# EasyEDA schematic sche.json
TITLE: Sheet_1; REV: 1.0; Date: 2020-10-10; Sheet: 1/1; Drawn By: wivach; Company: Your Company
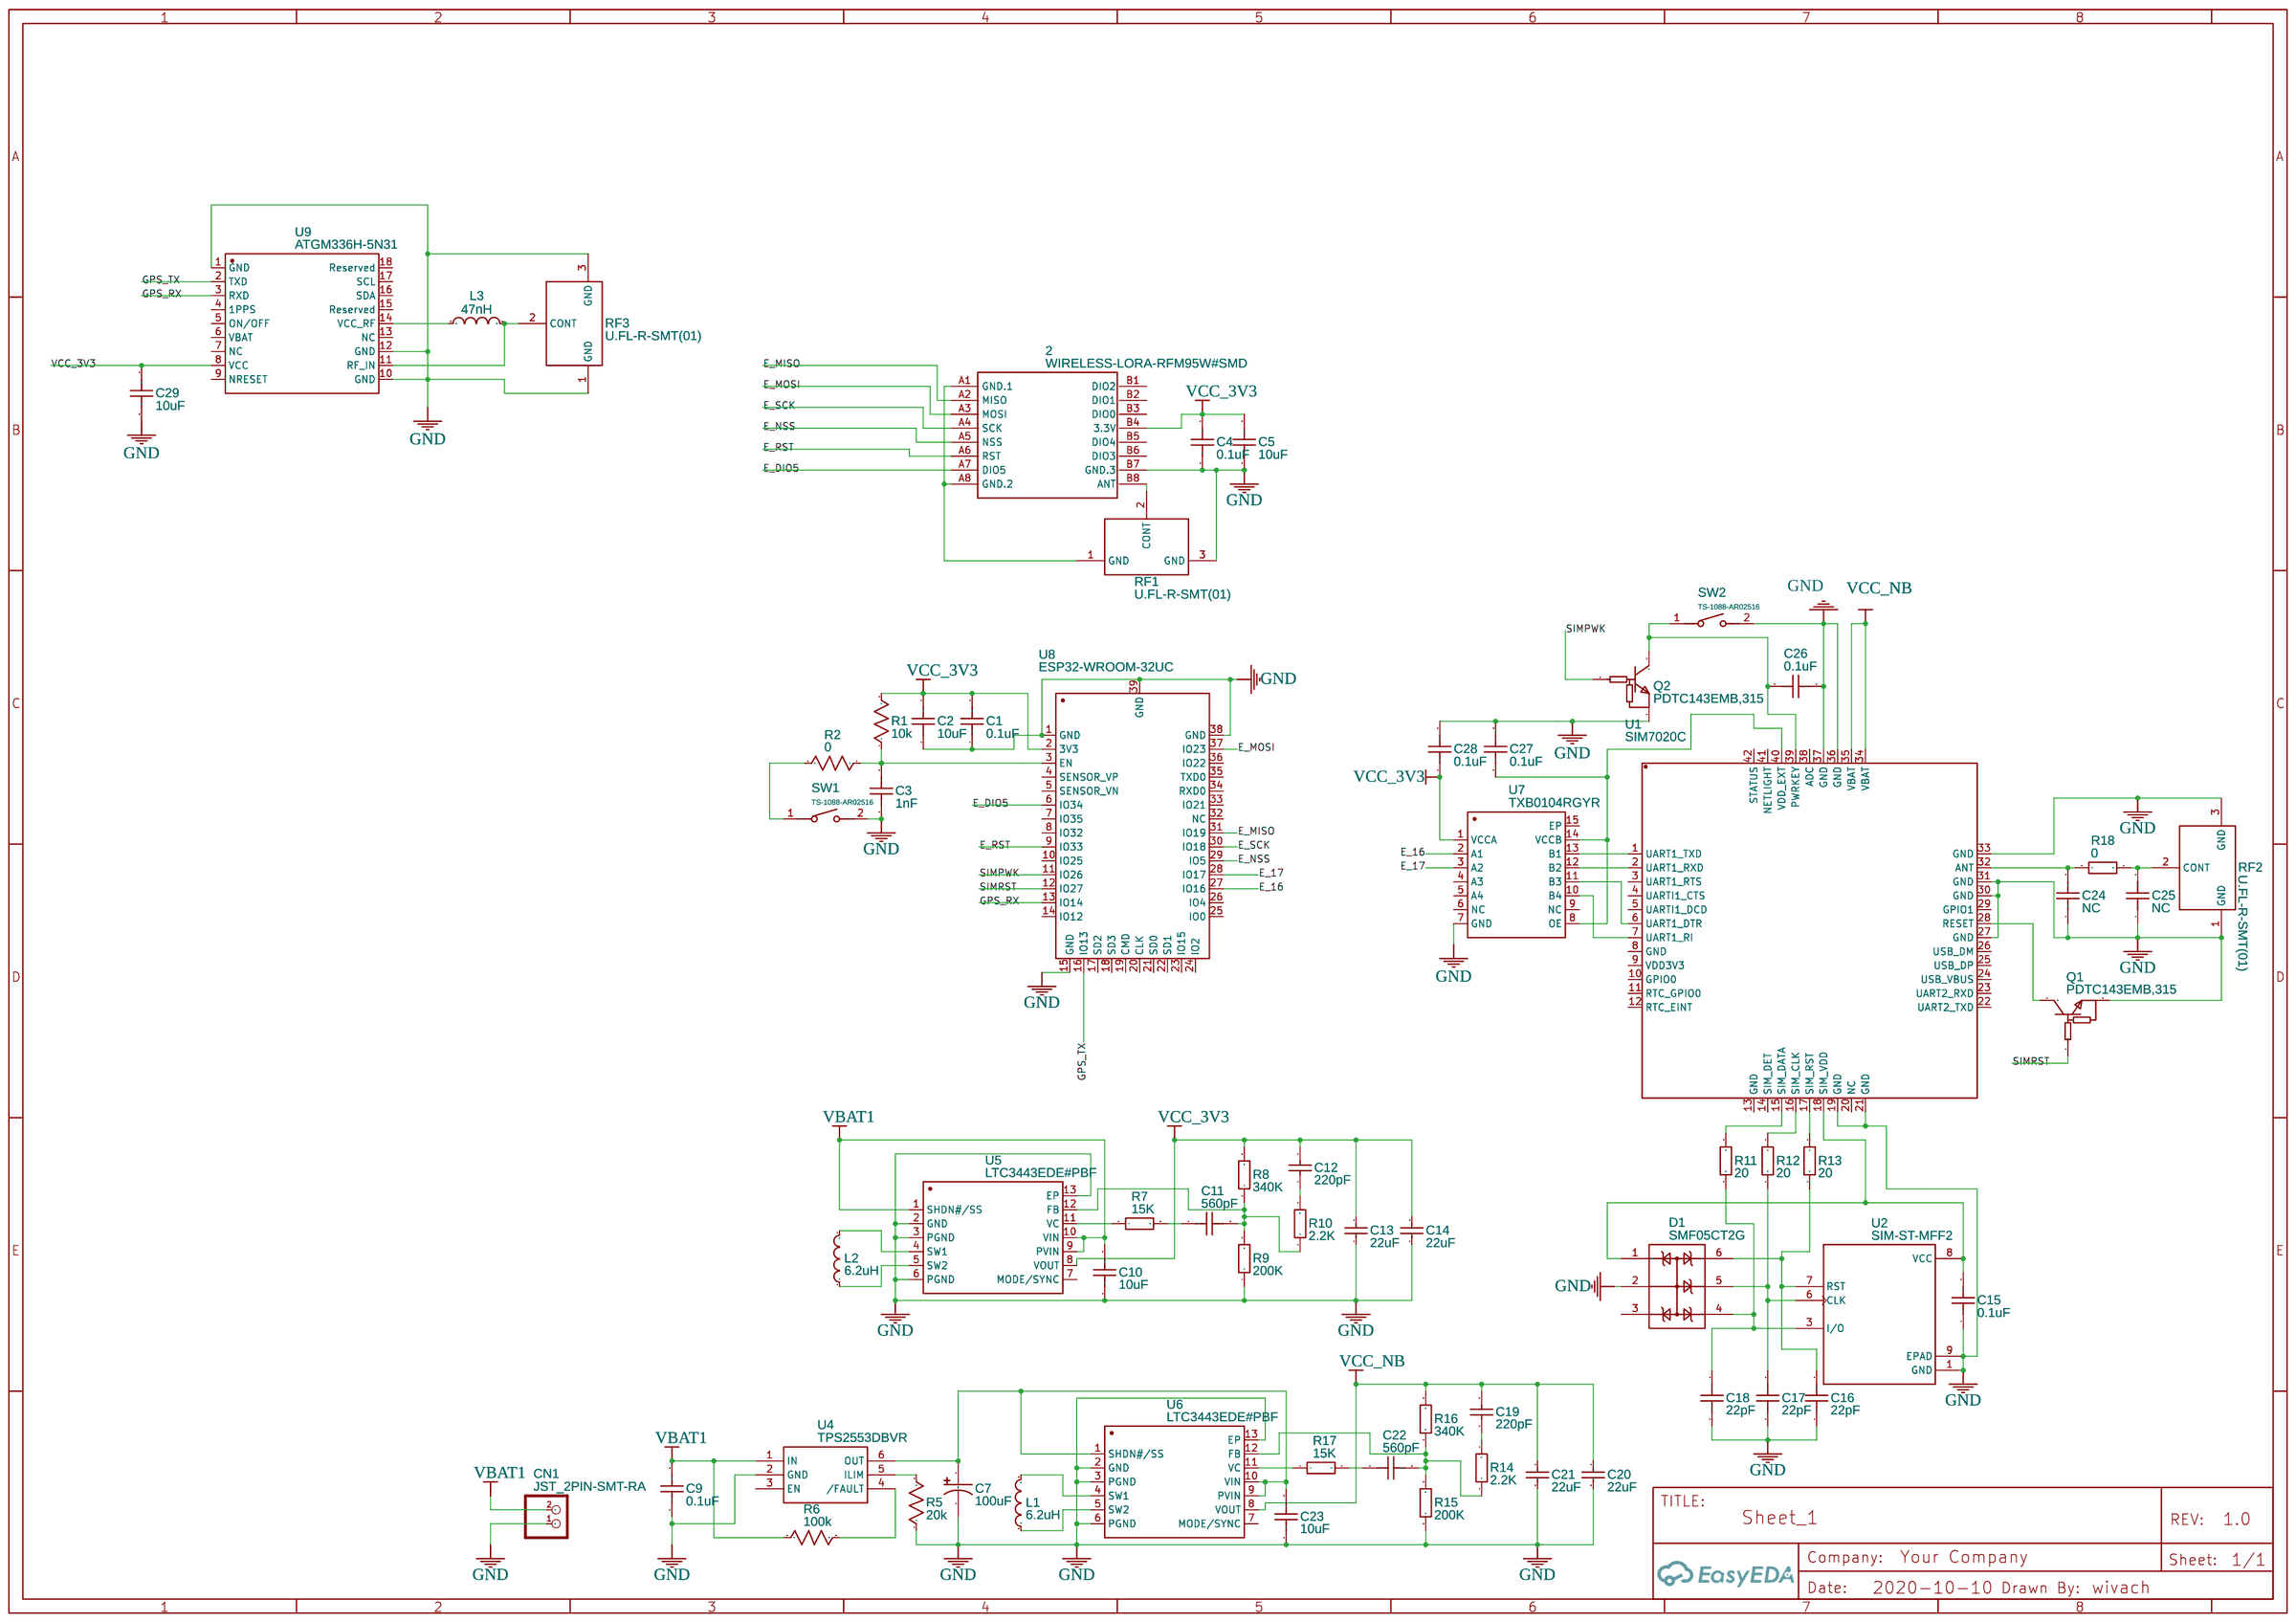
[diagram p0: schematic sheet]

## Parts
2  WIRELESS-LORA-RFM95W#SMD  [WIRELESS-LORA-RFM95W#SMD]
C1  0.1uF  [C0603]
C2  10uF  [C0603]
C3  1nF  [C0603]
C4  0.1uF  [C0603]
C5  10uF  [C0603]
C7  100uF  [CAP-SMD_L3.5-W2.8-R-RD]
C9  0.1uF  [C0603]
C10  10uF  [C0805]
C11  560pF  [C0603]
C12  220pF  [C0603]
C13  22uF  [C1206]
C14  22uF  [C1206]
C15  0.1uF  [C0603]
C16  22pF  [C0603]
C17  22pF  [C0603]
C18  22pF  [C0603]
C19  220pF  [C0603]
C20  22uF  [C1206]
C21  22uF  [C1206]
C22  560pF  [C0603]
C23  10uF  [C0805]
C24  NC  [C0603]
C25  NC  [C0603]
C26  0.1uF  [C0603]
C27  0.1uF  [C0603]
C28  0.1uF  [C0603]
C29  10uF  [C0603]
CN1  JST_2PIN-SMT-RA  [JST-PH-2-SMT-RA]
D1  SMF05CT2G  [SC-88-6_L2.0-W1.3-P0.65-LS2.1-BR]
L1  6.2uH  [IND-SMD_L6.0-W6.0]
L2  6.2uH  [IND-SMD_L6.0-W6.0]
L3  47nH  [IND-SMD_L6.0-W6.0]
Q1  PDTC143EMB,315  [SOT-883-3_L1.0-W0.6-BR]
Q2  PDTC143EMB,315  [SOT-883-3_L1.0-W0.6-BR]
R1  10k  [R0603]
R2  0  [R0603]
R5  20k  [R0603]
R6  100k  [R0603]
R7  15K  [R0603]
R8  340K  [R0603]
R9  200K  [R0603]
R10  2.2K  [R0603]
R11  20  [R0603]
R12  20  [R0603]
R13  20  [R0603]
R14  2.2K  [R0603]
R15  200K  [R0603]
R16  340K  [R0603]
R17  15K  [R0603]
R18  0  [R0603]
RF1  U.FL-R-SMT(01)  [ANT-SMD_UFL-R-SMT01]
RF2  U.FL-R-SMT(01)  [ANT-SMD_UFL-R-SMT01]
RF3  U.FL-R-SMT(01)  [ANT-SMD_UFL-R-SMT01]
SW1  TS-1088-AR02516  [SW-SMD_L4.0-W2.9-LS5.0]
SW2  TS-1088-AR02516  [SW-SMD_L4.0-W2.9-LS5.0]
U1  SIM7020C  [GSM-SMD_42P-L17.6-W15.7-P1.10-TL]
U2  SIM-ST-MFF2  [PSON127P500X600X82-9N]
U4  TPS2553DBVR  [SOT-23-6_L2.9-W1.6-P0.95-LS2.8-BR]
U5  LTC3443EDE#PBF  [DFN-12_L4.0-W3.0-P0.50-BL-EP]
U6  LTC3443EDE#PBF  [DFN-12_L4.0-W3.0-P0.50-BL-EP]
U7  TXB0104RGYR  [VQFN-14_L3.5-W3.5-P0.50-BL-EP]
U8  ESP32-WROOM-32UC  [WIFIM-SMD_38P-L19.2-W18.0-P1.27]
U9  ATGM336H-5N31  [GPSM-SMD_ATGM336H]

## Library data of the parts
2 = WIRELESS-LORA-RFM95W#SMD: Contributor: gtanaka6
C1 C4 C9 C15 C26-C28 = C_0603_US: Supplier Part: C77055; Supplier: LCSC; Contributor: LCEDA_Lib; Manufacturer Part: GRM188R71H104KA93D; Manufacturer: MuRata
C2 C5 C29 = C_0603_US: Supplier Part: C77041; Supplier: LCSC; Contributor: LCEDA_Lib; Manufacturer Part: GRM188R60J106ME47D; Package Display: No; Manufacturer: MuRata
C3 = C_0603_US: Supplier Part: C282515; Supplier: LCSC; Contributor: LCEDA_Lib; Manufacturer Part: TCC0603X7R102K500CT; Manufacturer: CCTC
C7 = TC212B107M010Y: Supplier: LCSC; Manufacturer: Sunlord; Contributor: LCSC; Supplier Part: C110782; LCSC Assembly: Yes; SMT Type: Extend
C10 C23 = C0805X5R106K160NT: Supplier: LCSC; Supplier Part: C466793; Manufacturer: SANYEAR; Contributor: LCSC
C11 C22 = 0603CG561J500NT: Supplier: LCSC; Supplier Part: C43962; Manufacturer: FH(Guangdong Fenghua Advanced Tech); Contributor: LCSC
C12 C19 = CL10B221KB8NNNC: Supplier: LCSC; Manufacturer: SAMSUNG; LCSC Assembly: Yes; Supplier Part: C1603; SMT Type: Basic
C13 C14 C20 C21 = JMK316ABJ226KL-T: Supplier: LCSC; Supplier Part: C478848; Manufacturer: Taiyo Yuden; Contributor: LCSC
C16-C18 = CC0603GRNPO9BN220: Supplier: LCSC; Supplier Part: C327276; Manufacturer: YAGEO; Contributor: LCSC
C24 C25 = C_0603_US: Contributor: LCEDA_Lib
CN1 = JST_2PIN-SMT-RA: JST 2-Pin Connectors of various flavors; Contributor: Adafruit; Manufacturer Part: S2B-PH-SM4-TB(LF)(SN); Supplier: LCSC; Manufacturer: JST Sales America; Supplier Part: C295747
D1 = SMF05CT2G: Supplier: LCSC; Supplier Part: C513065; Manufacturer: ON Semiconductor; Contributor: LCSC
L1-L3 = CDRH5D28NP-6R2NC: Supplier: LCSC; Supplier Part: C312979; Manufacturer: Sumida; Contributor: LCSC
Q1 Q2 = PDTC143EMB,315: Supplier: LCSC; Supplier Part: C552203; Manufacturer: Nexperia; Contributor: LCSC
R1 = R_0603_US: Supplier Part: C177337; Supplier: LCSC; Contributor: LCEDA_Lib; Manufacturer Part: RCT0310KJLF; Manufacturer: Hong Kong Resistors
R2 = R_0603_US: Supplier Part: C21189; Supplier: LCSC; Contributor: LCEDA_Lib; Manufacturer Part: 0603WAF0000T5E; Manufacturer: UniOhm
R5 = R_0603_US: Supplier Part: C305157; Supplier: LCSC; Contributor: LCEDA_Lib; Manufacturer Part: SR06X203JTL; Manufacturer: Huaxin S&T
R6 = R_0603_US: Supplier Part: C106230; Supplier: LCSC; Contributor: LCEDA_Lib; Manufacturer Part: RC0201JR-07100KL; Manufacturer: YAGEO
R7 R17 = ETCR0603F15K0K9: Supplier: LCSC; Supplier Part: C365386; Manufacturer: ResistorToday; Contributor: LCSC
R8 R16 = AC0603FR-07340KL: Supplier: LCSC; Supplier Part: C227826; Manufacturer: YAGEO; Contributor: LCSC
R9 R15 = AF0603FR-07200KL: Supplier: LCSC; Manufacturer: YAGEO; Contributor: LCSC; Supplier Part: C144091
R10 R14 = RMC06032.2K5%N: Supplier: LCSC; Supplier Part: C325643; Manufacturer: Tyohm; Contributor: LCSC
R11-R13 = ERJUP3F20R0V: Supplier: LCSC; Supplier Part: C544033; Manufacturer: PANASONIC; Contributor: LCSC
R18 = ERJUP3F20R0V: Supplier: LCSC; Supplier Part: C544033; Manufacturer: PANASONIC; Contributor: LCSC; Package Display: No
RF1-RF3 = U.FL-R-SMT(01): Supplier: LCSC; Supplier Part: C434812; Manufacturer: Hirose; Contributor: LCSC
SW1 SW2 = TS-1088-AR02516: Supplier: LCSC; Supplier Part: C720478; Manufacturer: XUNPU; Contributor: LCSC
U1 = SIM7020C: Supplier: LCSC; Supplier Part: C188351; Manufacturer: SIMCom Wireless Solutions; Contributor: LCSC
U2 = SIM-ST-MFF2: Contributor: Bharathmc; Package Display: No
U4 = TPS2553DBVR: Supplier: LCSC; Manufacturer: TI; image: //image.lceda.cn/szlcsc/C55266.jpg; Supplier Part: C55266; LCSC Assembly: Yes; SMT Type: Extend
U5 U6 = LTC3443EDE#PBF: Supplier: LCSC; Supplier Part: C684784; Manufacturer: Analog Devices; Contributor: LCSC
U7 = TXB0104RGYR: Supplier: LCSC; Supplier Part: C400708; Manufacturer: Texas Instruments; Contributor: LCSC
U8 = ESP32-WROOM-32UC: Supplier: LCSC; Supplier Part: C473014; Manufacturer: Espressif Systems; Contributor: LCSC
U9 = ATGM336H-5N31: Supplier: LCSC; Manufacturer: ZHONGKEWEI; Supplier Part: C90770

## Nets
GND: 2.B7(GND.3) C1.1 C2.1 C3.1 C4.1 C5.1 C7.2 C9.1 C10.1 C13.1 C14.1 C15.1 C16.1 C17.1 C18.1 C20.1 C21.1 C23.1 C24.1 C25.1 C26.1 C27.2 C28.2 C29.1 CN1.1(2) D1.2(A) Q1.2(E) Q2.2(E) R5.1 R9.1 R15.1 RF1.3(GND) RF2.1(GND) RF2.3(GND) RF3.1(GND) RF3.3(GND) SW1.2 SW2.2 U1.19(GND) U1.21(GND) U1.27(GND) U1.30(GND) U1.31(GND) U1.33(GND) U1.36(GND) U1.37(GND) U2.1(GND) U2.9(EPAD) U4.2(GND) U5.2(GND) U5.3(PGND) U5.6(PGND) U5.13(EP) U6.2(GND) U6.3(PGND) U6.6(PGND) U6.13(EP) U7.7(GND) U8.1(GND) U8.15(GND) U8.38(GND) U8.39(GND) U9.1(GND) U9.10(GND) U9.12(GND)
VBAT1: C9.2 C10.2 CN1.2(1) R6.1 U4.1(IN) U5.1(SHDN#/SS) U5.9(PVIN) U5.10(VIN)
VCC_3V3: 2.B4(3.3V) C1.2 C2.2 C4.2 C5.2 C12.2 C13.2 C14.2 C28.1 C29.2 R1.2 R8.2 U5.8(VOUT) U7.1(VCCA) U8.2(3V3) U9.8(VCC)
VCC_NB: C19.2 C20.2 C21.2 R16.2 U1.34(VBAT) U1.35(VBAT) U6.8(VOUT)
E_16: U7.2(A1) U8.27(IO16)
E_17: U7.3(A2) U8.28(IO17)
E_DIO5: 2.A7(DIO5) U8.6(IO34)
E_MISO: 2.A2(MISO) U8.31(IO19)
E_MOSI: 2.A3(MOSI) U8.37(IO23)
E_NSS: 2.A5(NSS) U8.29(IO5)
E_RST: 2.A6(RST) U8.9(IO33)
E_SCK: 2.A4(SCK) U8.30(IO18)
GPS_RX: U8.13(IO14) U9.3(RXD)
GPS_TX: U8.16(IO13) U9.2(TXD)
SIMPWK: Q2.1(B) U8.11(IO26)
SIMRST: Q1.1(B) U8.12(IO27)
Net-(2-A1): 2.A1(GND.1) 2.A8(GND.2) RF1.1(GND)
Net-(2-B8): 2.B8(ANT) RF1.2(CONT)
Net-(C3-2): C3.2 R1.1 R2.1 U8.3(EN)
Net-(C7-1): C7.1 C23.2 U4.6(OUT) U6.1(SHDN#/SS) U6.9(PVIN) U6.10(VIN)
Net-(C11-1): C11.1 R7.2
Net-(C11-2): C11.2 R8.1 R9.2 R10.1 U5.12(FB)
Net-(C12-1): C12.1 R10.2
Net-(C15-2): C15.2 D1.1(C1) U1.18(SIM_VDD) U2.8(VCC)
Net-(C16-2): C16.2 D1.6(C5) R13.1 U2.7(RST)
Net-(C17-2): C17.2 D1.5(C4) R12.1 U2.6(CLK)
Net-(C18-2): C18.2 D1.4(C3) R11.1 U2.3(I/O)
Net-(C19-1): C19.1 R14.2
Net-(C22-1): C22.1 R17.2
Net-(C22-2): C22.2 R14.1 R15.2 R16.1 U6.12(FB)
Net-(C24-2): C24.2 R18.2 U1.32(ANT)
Net-(C25-2): C25.2 R18.1 RF2.2(CONT)
Net-(C26-2): C26.2 Q2.3(C) SW2.1 U1.39(PWRKEY)
Net-(C27-1): C27.1 U1.40(VDD_EXT) U7.8(OE) U7.14(VCCB)
Net-(L1-1): L1.1 U6.5(SW2)
Net-(L1-2): L1.2 U6.4(SW1)
Net-(L2-1): L2.1 U5.5(SW2)
Net-(L2-2): L2.2 U5.4(SW1)
Net-(L3-1): L3.1 U9.14(VCC_RF)
Net-(L3-2): L3.2 RF3.2(CONT) U9.11(RF_IN)
Net-(Q1-3): Q1.3(C) U1.28(RESET)
Net-(R2-2): R2.2 SW1.1
Net-(R5-2): R5.2 U4.5(ILIM)
Net-(R6-2): R6.2 U4.4(/FAULT)
Net-(R7-1): R7.1 U5.11(VC)
Net-(R11-2): R11.2 U1.15(SIM_DATA)
Net-(R12-2): R12.2 U1.16(SIM_CLK)
Net-(R13-2): R13.2 U1.17(SIM_RST)
Net-(R17-1): R17.1 U6.11(VC)
Net-(U1-1): U1.1(UART1_TXD) U7.13(B1)
Net-(U1-2): U1.2(UART1_RXD) U7.12(B2)
Net-(U1-6): U1.6(UART1_DTR) U7.11(B3)
Net-(U1-7): U1.7(UART1_RI) U7.10(B4)

Not connected (* = marked no-connect by the designer): 2 B1(DIO2) B2(DIO1) B3(DIO0) B5(DIO4) B6(DIO3); D1 3(C2); U1 3(UART1_RTS) 4(UARTI1_CTS) 5(UARTI1_DCD) 8(GND) 9(VDD3V3) 10(GPIO0) 11(RTC_GPIO0) 12(RTC_EINT) 13(GND) 14(SIM_DET) 20(NC) 22(UART2_TXD) 23(UART2_RXD) 24(USB_VBUS) 25(USB_DP) 26(USB_DM) 29(GPIO1) 38(ADC) 41(NETLIGHT) 42(STATUS); U4 3(EN); U5 7(MODE/SYNC); U6 7(MODE/SYNC); U7 4(A3) 5(A4) 6(NC) 9(NC) 15(EP); U8 4(SENSOR_VP) 5(SENSOR_VN) 7(IO35) 8(IO32) 10(IO25) 14(IO12) 17(SD2) 18(SD3) 19(CMD) 20(CLK) 21(SD0) 22(SD1) 23(IO15) 24(IO2) 25(IO0) 26(IO4) 32(NC) 33(IO21) 34(RXD0) 35(TXD0) 36(IO22); U9 4(1PPS) 5(ON/OFF) 6(VBAT) 7(NC) 9(NRESET) 13(NC) 15(Reserved) 16(SDA) 17(SCL) 18(Reserved)
